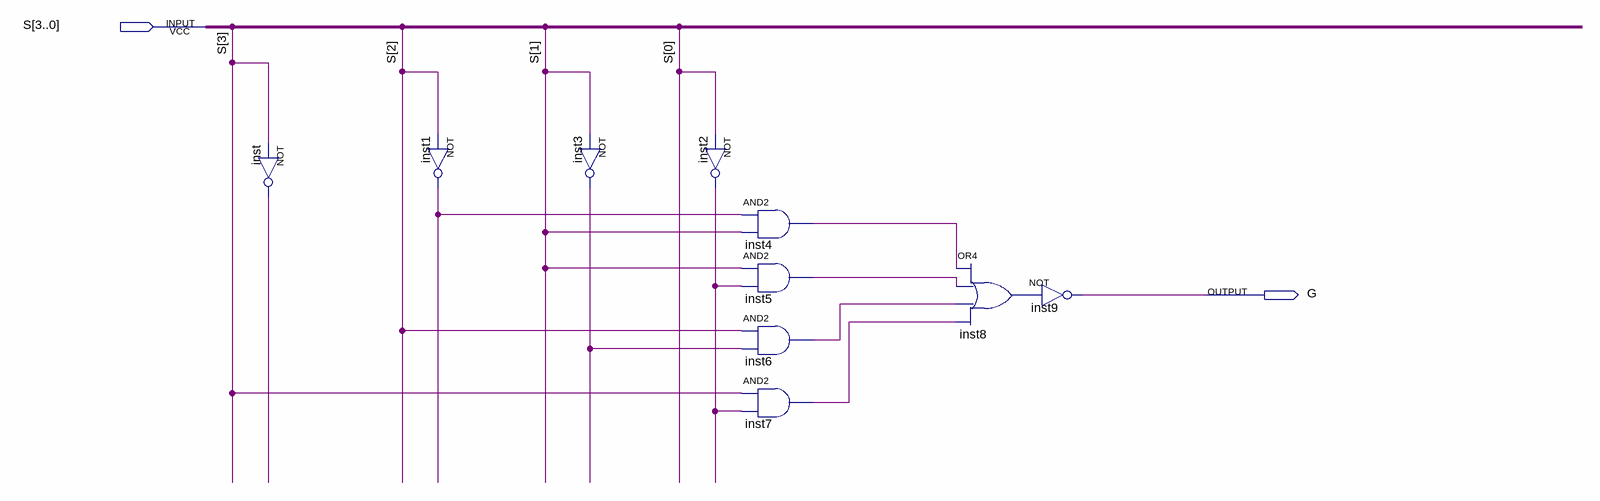
[diagram p0: schematic sheet]
// Quartus schematic DisplayG.bdf as structural Verilog: 10 symbols, 2 pins
module DisplayG (
  input  [3:0] S,
  output G
);

  wire inst1_out, inst2_out, inst3_out, inst4_out, inst5_out, inst6_out, inst7_out, inst8_out, inst_out;

  not inst (inst_out, S[3]);
  not inst1 (inst1_out, S[2]);
  not inst3 (inst3_out, S[1]);
  not inst2 (inst2_out, S[0]);
  and inst4 (inst4_out, inst1_out, S[1]);
  and inst5 (inst5_out, S[1], inst2_out);
  and inst6 (inst6_out, S[2], inst3_out);
  and inst7 (inst7_out, S[3], inst2_out);
  or inst8 (inst8_out, inst4_out, inst5_out, inst6_out, inst7_out);
  not inst9 (G, inst8_out);
endmodule
